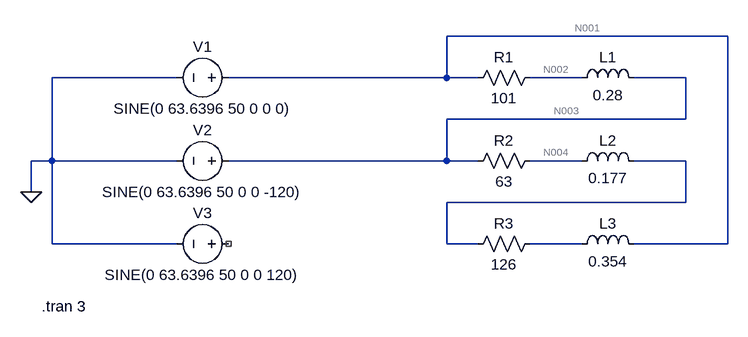
[diagram p0: schematic p2-6.asc]
p2-6.asc, the LTspice schematic file:
Version 4.1
SHEET 1 880 680
WIRE 864 -112 432 -112
WIRE 16 -48 -176 -48
WIRE 432 -48 432 -112
WIRE 432 -48 96 -48
WIRE 480 -48 432 -48
WIRE 640 -48 560 -48
WIRE 800 -48 720 -48
WIRE 800 16 800 -48
WIRE 800 16 432 16
WIRE -176 80 -176 -48
WIRE -176 80 -208 80
WIRE 16 80 -176 80
WIRE 432 80 432 16
WIRE 432 80 96 80
WIRE 480 80 432 80
WIRE 640 80 560 80
WIRE 800 80 720 80
WIRE -208 128 -208 80
WIRE 800 144 800 80
WIRE 800 144 432 144
WIRE -176 208 -176 80
WIRE 16 208 -176 208
WIRE 432 208 432 144
WIRE 480 208 432 208
WIRE 640 208 560 208
WIRE 864 208 864 -112
WIRE 864 208 720 208
FLAG -208 128 0
SYMBOL voltage 112 -48 R90
WINDOW 0 -32 56 VBottom 2
WINDOW 3 32 56 VTop 2
WINDOW 123 0 0 Left 0
WINDOW 39 0 0 Left 0
SYMATTR InstName V1
SYMATTR Value SINE(0 63.6396 50 0 0 0)
SYMBOL voltage 112 80 R90
WINDOW 0 -32 56 VBottom 2
WINDOW 3 32 56 VTop 2
WINDOW 123 0 0 Left 0
WINDOW 39 0 0 Left 0
SYMATTR InstName V2
SYMATTR Value SINE(0 63.6396 50 0 0 -120)
SYMBOL voltage 112 208 R90
WINDOW 0 -32 56 VBottom 2
WINDOW 3 32 56 VTop 2
WINDOW 123 0 0 Left 0
WINDOW 39 0 0 Left 0
SYMATTR InstName V3
SYMATTR Value SINE(0 63.6396 50 0 0 120)
SYMBOL res 576 -64 R90
WINDOW 0 0 56 VBottom 2
WINDOW 3 32 56 VTop 2
SYMATTR InstName R1
SYMATTR Value 101
SYMBOL res 576 64 R90
WINDOW 0 0 56 VBottom 2
WINDOW 3 32 56 VTop 2
SYMATTR InstName R2
SYMATTR Value 63
SYMBOL res 576 192 R90
WINDOW 0 0 56 VBottom 2
WINDOW 3 32 56 VTop 2
SYMATTR InstName R3
SYMATTR Value 126
SYMBOL ind 624 -32 R270
WINDOW 0 32 56 VTop 2
WINDOW 3 5 56 VBottom 2
SYMATTR InstName L1
SYMATTR Value 0.28
SYMATTR SpiceLine Rser=0
SYMBOL ind 624 96 R270
WINDOW 0 32 56 VTop 2
WINDOW 3 5 56 VBottom 2
SYMATTR InstName L2
SYMATTR Value 0.177
SYMATTR SpiceLine Rser=0
SYMBOL ind 624 224 R270
WINDOW 0 32 56 VTop 2
WINDOW 3 5 56 VBottom 2
SYMATTR InstName L3
SYMATTR Value 0.354
SYMATTR SpiceLine Rser=0
TEXT -192 304 Left 2 !.tran 3

The netlist it stands for:
* p2-6.asc
V1 N001 0 SINE(0 63.6396 50 0 0 0)
V2 N003 0 SINE(0 63.6396 50 0 0 -120)
V3 NC_01 0 SINE(0 63.6396 50 0 0 120)
R1 N002 N001 101
R2 N004 N003 63
R3 N006 N005 126
L1 N002 N003 0.28 Rser=0
L2 N004 N005 0.177 Rser=0
L3 N006 N001 0.354 Rser=0
.tran 3
.backanno
.end

* Results of the author's LTspice run, read from the files saved beside the schematic
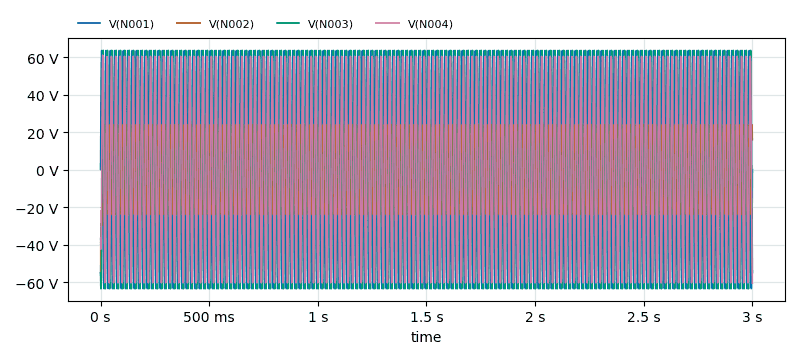
[diagram p1: Transient Analysis of p2-6.asc, plotted from the saved traces]
* Transient Analysis, 1 run:
*   V(N001): min -63.51 V, max 63.52 V, average 26.02 µV, rms 45.01 V, last 0 V
*   V(N002): min -55.11 V, max 23.95 V, average -66.03 mV, rms 16.99 V, last 16.07 V
*   V(N003): min -63.63 V, max 63.62 V, average -249.4 µV, rms 44.99 V, last -55.11 V
*   V(N004): min -60.62 V, max 61.05 V, average 22.2 mV, rms 42.99 V, last -60.62 V